# Altium project Transmitter 2.4GHz.PrjPcb
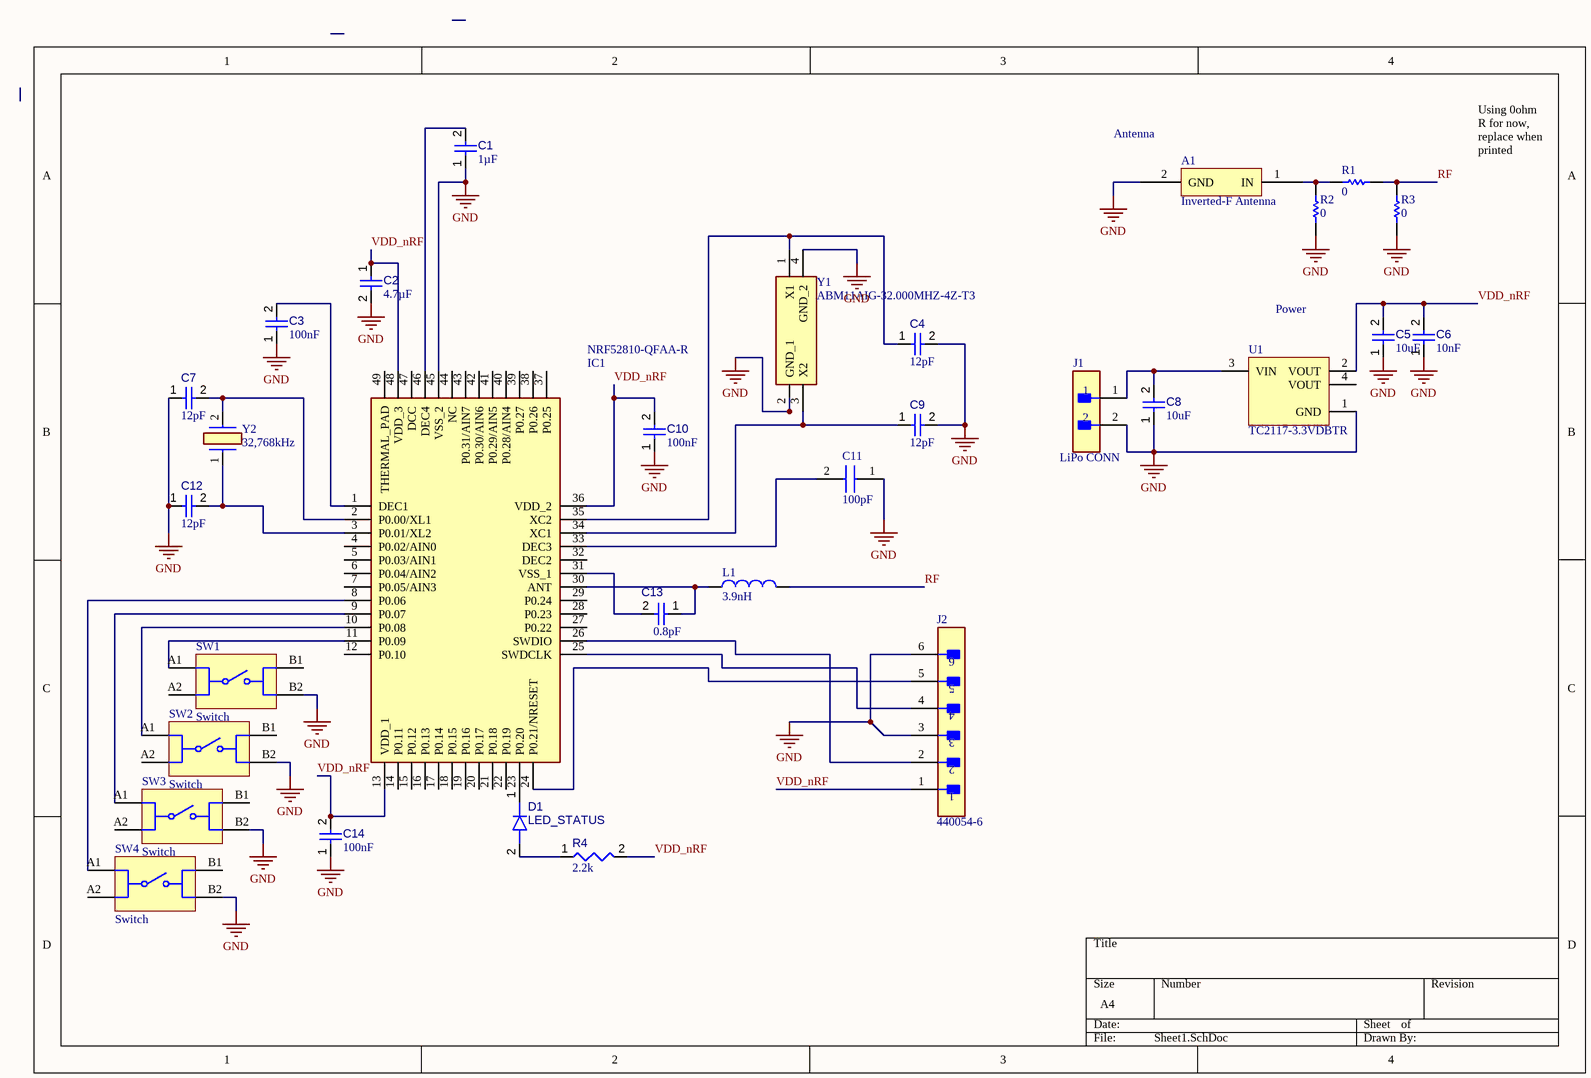
[diagram p0: Sheet1.SchDoc]
1 sheet, 31 parts. Net scope: global (net labels, ports and power ports of the same name join across sheets).
Board file: PCB1.PcbDoc

## Sheet Sheet1.SchDoc
size A4; SheetNumber: 1; SheetTotal: 1

### Parts
A1  Inverted-F Antenna  [New footprint 1]  (net tie, no BOM)
C1  value 1µF  [CAPC0603(1608)100_L]  (hidden comment: Capacitor 1µF +/-0.1% 25V 0603)
C2  value 4.7µF  [CAPC0603(1608)100_L]  (hidden comment: Capacitor 4.7µF +/-20% 10V 0603)
C3  value 100nF  [CAPC1608X90X40NL10T20]  (hidden comment: Capacitor 100 nF +/-10% 50 V 0603)
C4  value 12pF  [CAPC0402(1005)33_L]  (hidden comment: Capacitor 12pF +/-10% 50V 0402)
C5  value 10uF  [CAPC0402(1005)33_L]  (hidden comment: Capacitor 12pF +/-10% 50V 0402)
C6  value 10nF  [CAPC0402(1005)33_L]  (hidden comment: Capacitor 12pF +/-10% 50V 0402)
C7  value 12pF  [CAPC0402(1005)33_L]  (hidden comment: Capacitor 12pF +/-10% 50V 0402)
C8  value 10uF  [CAPC0402(1005)33_L]  (hidden comment: Capacitor 12pF +/-10% 50V 0402)
C9  value 12pF  [CAPC0402(1005)33_L]  (hidden comment: Capacitor 12pF +/-10% 50V 0402)
C10  value 100nF  [CAPC1608X90X40NL10T20]  (hidden comment: Capacitor 100 nF +/-10% 50 V 0603)
C11  100pF  [CAPC2012X135N]
C12  value 12pF  [CAPC0402(1005)33_L]  (hidden comment: Capacitor 12pF +/-10% 50V 0402)
C13  value 0.8pF  [CAPC1005X06N]  (hidden comment: 04023J0R8ABSTR)
C14  value 100nF  [CAPC1608X90X40NL10T20]  (hidden comment: Capacitor 100 nF +/-10% 50 V 0603)
D1  LED_STATUS  [CAPCP1508X06N]
IC1  NRF52810-QFAA-R  [QFN40P600X600X90-49N-D]
J1  LiPo CONN  [FP-440054-2-MFG]
J2  440054-6  [FP-440054-6-MFG]
L1  value 3.9nH  [CAPC1005X06N]  (hidden comment: 0402R-3N9J)
R1  value 0  [RESC1005X40X25ML05T10]  (hidden comment: Resistor 0R 0402 63 mW)
R2  value 0  [RESC1005X40X25ML05T10]  (hidden comment: Resistor 0R 0402 63 mW)
R3  value 0  [RESC1005X40X25ML05T10]  (hidden comment: Resistor 0R 0402 63 mW)
R4  value 2.2k  [RESC0402(1005)_L]  (hidden comment: Resistor 2K2  +/-5 % 0402 63 mW)
SW1  Switch  [430471035826]
SW2  Switch  [430471035826]
SW3  Switch  [430471035826]
SW4  Switch  [430471035826]
U1  TC2117-3.3VDBTR  [SOT-223-DB3_N]
Y1  ABM11AIG-32.000MHZ-4Z-T3  [ABM11AIG16000MHZ81ZT]
Y2  32,768kHz  [1TJH125DR1A0058]

### Nets
GND: A1.2(GND) C1.1 C2.2 C3.1 C4.2 C5.1 C6.1 C7.1 C8.1 C9.2 C10.1 C11.1 C12.1 C14.1 IC1.45(VSS_2) J1.2 J2.3 J2.6 R2.1 R3.1 SW1.B2 SW2.B2 SW3.B2 SW4.B2 U1.1(GND) Y1.2(GND_1) Y1.4(GND_2)
RF: L1.2 R1.2 R3.2
VDD_nRF: C2.1 C5.2 C6.2 C10.2 C14.2 IC1.13(VDD_1) IC1.36(VDD_2) IC1.48(VDD_3) J2.1 R4.2 U1.2(VOUT)
NetA1_1: A1.1(IN) R1.1 R2.2
NetC1_2: C1.2 IC1.46(DEC4)
NetC3_2: C3.2 IC1.1(DEC1)
NetC4_1: C4.1 IC1.35(XC2) Y1.1(X1)
NetC7_2: C7.2 IC1.2(P0.00/XL1) Y2.2
NetC8_2: C8.2 J1.1 U1.3(VIN)
NetC9_1: C9.1 IC1.34(XC1) Y1.3(X2)
NetC11_2: C11.2 IC1.33(DEC3)
NetC12_2: C12.2 IC1.3(P0.01/XL2) Y2.1
NetC13_1: C13.1 IC1.30(ANT) L1.1
NetC13_2: C13.2 IC1.31(VSS_1)
NetD1_1: D1.1(K) IC1.23(P0.20)
NetD1_2: D1.2(A) R4.1
NetIC1_8: IC1.8(P0.06) SW4.A1
NetIC1_9: IC1.9(P0.07) SW3.A1
NetIC1_10: IC1.10(P0.08) SW2.A1
NetIC1_11: IC1.11(P0.09) SW1.A1
NetIC1_24: IC1.24(P0.21/NRESET) J2.5
NetIC1_25: IC1.25(SWDCLK) J2.4
NetIC1_26: IC1.26(SWDIO) J2.2

Not connected (* = marked no-connect by the designer): IC1 4(P0.02/AIN0) 5(P0.03/AIN1) 6(P0.04/AIN2) 7(P0.05/AIN3) 12(P0.10) 14(P0.11) 15(P0.12) 16(P0.13) 17(P0.14) 18(P0.15) 19(P0.16) 20(P0.17) 21(P0.18) 22(P0.19) 27(P0.22) 28(P0.23) 29(P0.24) 32(DEC2) 37(P0.25) 38(P0.26) 39(P0.27) 40(P0.28/AIN4) 41(P0.29/AIN5) 42(P0.30/AIN6) 43(P0.31/AIN7) 44(NC) 47(DCC) 49(THERMAL_PAD); SW1 A2 B1; SW2 A2 B1; SW3 A2 B1; SW4 A2 B1; U1 4(VOUT)

### Notes on the sheet
- (near A1) Antenna
- Using 0ohm R for now, replace when printed
- Power

### Library data of the parts
A1 = CMP-00025-00003-2: FR4 material 2.48GHz Inverted-F antenna; Frequency: 2.4GHz
C1 = CMP-001-00055-4: Chip Capacitor, 1µF +/-0.1%, 25V, 0603, Thickness 1 mm; Tolerance: 20%; Min Operating Temperature: -55°C; Max Operating Temperature: 85°C; Voltage Rating: 25V; Mounting Technology: SMT; Case/Package: 0603; Pins: 2
C2 = CMP-001-00076-4: Chip Capacitor, 4.7µF +/-20%, 10V, 0603, Thickness 1 mm; Tolerance: 10%; Mounting Technology: SMT; Case/Package: 0603; Pins: 2; Min Operating Temperature: -55°C; Max Operating Temperature: 85°C; Voltage Rating: 10V
C3 C10 C14 = CMP-001-00017-6: Chip Capacitor, 100 nF, +/- 10%, 50 V, 0603 (1608 Metric); Voltage Rating: 50V; Capacitor Type: Ceramic; Tolerance: 10%; Mounting Technology: SM; Max Operating Temperature: 125°C; RoHS Compliant: True; Pins: 2; Case/Package: 0603; Min Operating Temperature: -55°C
C4-C9 C12 = CMP-001-00072-4: Chip Capacitor, 12pF +/-10%, 50V, 0402, Thickness 0.33 mm; Tolerance: 20%; Pins: 2; Max Operating Temperature: 85°C; Case/Package: 0402; Voltage Rating: 50V; Mounting Technology: SMT; Min Operating Temperature: -55°C
C11 = CL21C101JC61PNC: Capacitor; Manufacturer_Name: SAMSUNG; Datasheet Link: https://datasheet.datasheetarchive.com/originals/distributors/Datasheets-DGA8/2472830.pdf; Height: 1.35mm; Manufacturer_Part_Number: CL21C101JC61PNC; Mouser Part Number: 187-CL21C101JC61PNC; Mouser Price/Stock: https://www.mouser.co.uk/ProductDetail/Samsung-Electro-Mechanics/CL21C101JC61PNC?qs=Ay79KZaUeZC4hCSSt5%2FdPg%3D%3D; Arrow Part Number: CL21C101JC61PNC; Arrow Price/Stock: https://www.arrow.com/en/products/cl21c101jc61pnc/samsung-electro-mechanics?utm_currency=USD&region=nac
C13 = CMP-001-00091-1: 0402 0.8 pF 25 V ±0.5 pF Tolerance SMT Thin-Film RF/Microwave Capacitor; Voltage Rating: 25V; Min Operating Temperature: -55°C; Max Operating Temperature: 125°C; Case/Package: 0402; Pins: 2; Mounting Technology: Surface Mount
D1 = CMP-004-00034-1: 1.6 X 0.8 MM SMD CHIP LED LAMP Single Color LED, Green, Water Clear, 0.7mm; Forward Current: 25mA; Forward Voltage: 3.3V; Max Operating Temperature: 85°C; Case/Package: 0603; Min Operating Temperature: -40°C; Mounting Technology: Surface Mount
IC1 = NRF52810-QFAA-R: Integrated Circuit; Manufacturer_Name: Nordic Semiconductor; Datasheet Link: http://infocenter.nordicsemi.com/pdf/nRF52810_PS_v1.0.pdf; Height: 0.9mm; Manufacturer_Part_Number: NRF52810-QFAA-R; Mouser Part Number: 949-NRF52810-QFAA-R; Mouser Price/Stock: https://www.mouser.co.uk/ProductDetail/Nordic-Semiconductor/NRF52810-QFAA-R?qs=gt1LBUVyoHmUcm9gtTuf%252BA%3D%3D; Arrow Part Number: NRF52810-QFAA-R; Arrow Price/Stock: https://www.arrow.com/en/products/nrf52810-qfaa-r/nordic-semiconductor?utm_currency=USD&region=nac
J1 = CMP-03369-000005-1: CONN HEADER VERT 2POS 2MM; Manufacturer: TE Connectivity; Manufacturer Part Number: 440054-2; Conn Gender: Male; Conn Orientation: Vertical; Voltage Rating: 250V; Number Of Contacts: 2; Current Rating: 3A; ComponentLink2Description: Datasheet; Temperature Range Low: -25°C; Contact Material: Tin,Nickel; Device Class L3: unset; Digikey Description: CONN HEADER VERT 2POS 2MM; Temperature: -25°C to +85°C; Mouser Description: Headers & Wire Housings 2.0mm HDR 2pos VERT HPI; Package: 440054-2; Lead Free: Yes; ComponentLink2URL: https://www.te.com/usa-en/product-440054-2.datasheet.pdf; Number Of Rows: 1; Octopart: https://octopart.com/440054-2-te+connectivity-40237927; Category: Conn; Temperature Range High: +85°C; Footprint Url: https://www.te.com/commerce/DocumentDelivery/DDEController?Action=showdoc&DocId=Customer+Drawing%7F440054%7FF6%7Fpdf%7FEnglish%7FENG_CD_440054_F6.pdf%7F440054-2; Pitch: 2mm; Device Class L1: Connectors; RoHS: TRUE; Height: 6.35mm; Device Class L2: Headers and Wire Housings; Automotive: No
J2 = CMP-002-00074-1: Pin Header, Wire-to-Board, 2 mm, 1 Rows, 6 Contacts, Through Hole Straight, HPI Series; Connector Type: Header, Pin, Plug; Voltage Rating: 250V; Max Operating Temperature: 85°C; Pins: 6; Mounting Technology: Through Hole; Min Operating Temperature: -25°C
L1 = CMP-006-00024-1: General Purpose Inductor, 0.0039uH, 5%, 1 Element, Ceramic-Core, SMD, 0402; Current Rating: 840mA; Self Resonant Frequency: 5.8GHz; Case/Package: 0402; Max Operating Temperature: 125°C; Max Current Rating: 840mA; Mounting Technology: Surface Mount; Tolerance: 5%; Min Operating Temperature: -40°C
R1-R3 = CMP-009-00004-5: Chip Resistor, 0 Ohm, 0.063 W, -55 to 155 degC, 0402 (1005 Metric); Power: 63mW; Voltage Rating: 50V; Max Operating Temperature: 155°C; Pins: 2; RoHS Compliant: True; Min Operating Temperature: -55°C; Mounting Technology: SM; Case/Package: 0402
R4 = CMP-009-00166-3: Chip Resistor, 2,2 kOhms, +/-5 %, 63 mW, -55 to 155 degC, 0402; Power: 63mW; Tolerance: 5%; Pins: 2; Min Operating Temperature: -55°C; Max Operating Temperature: 155°C; Case/Package: 0402
SW1-SW4 = CMP-011-00014-1: Tactile Switch, 0.05A, 12Vdc, 260Gf, Smd Rohs Compliant: Yes; Voltage Rating: 12V; Throw Configuration: SPST; Current Rating: 50mA; Min Operating Temperature: -40°C; Max Operating Temperature: 85°C
U1 = CMP-0136-00509-2: 800 mA Fixed Low Dropout Positive Regulator, 3-Pin SOT-223, Extended Temperature, Tape and Reel; DatasheetVersion: revD, Sep-2010; PackageDescription: 3-Lead Plastic Small Outline Transistor (DB) [SOT-223]; PackageReference: SOT-223-DB3; PackageVersion: revBB, Aug-2009
Y1 = ABM11AIG-32.000MHZ-4Z-T3: Crystal or Oscillator; Manufacturer_Name: ABRACON; Datasheet Link: https://abracon.com/AIGcrystals/ABM11AIG.pdf; Height: 0.55mm; Manufacturer_Part_Number: ABM11AIG-32.000MHZ-4Z-T3; Mouser Part Number: 815-M11AIG-32-4ZT3; Mouser Price/Stock: https://www.mouser.co.uk/ProductDetail/ABRACON/ABM11AIG-32.000MHZ-4Z-T3?qs=gG6m684uYP6ePIn58i2qHg%3D%3D; Arrow Part Number: ABM11AIG-32.000MHZ-4Z-T3; Arrow Price/Stock: https://www.arrow.com/en/products/abm11aig-32.000mhz-4z-t3/abracon.html?utm_currency=USD&region=nac
Y2 = 1TJH125DR1A0058: Crystal or Oscillator; Manufacturer_Name: KDS Daishinku; Datasheet Link: https://datasheet.lcsc.com/szlcsc/1810301228_KDS-Daishinku-1TJH125DR1A0058_C253734.pdf; Height: 0.5mm; Manufacturer_Part_Number: 1TJH125DR1A0058